# Altium schematic sheet 9.6 GHz LO Driver.SchDoc: 9.6 GHz LO Driver
size D; DrawnBy: C. Lewis; Engineer: C. Lewis; Address1: 4650 NORRIS CANYON RD.; Address2: SAN RAMON, CA 94583; DocumentNumber: 35133; Revision: D; SheetNumber: 16; SheetTotal: 20
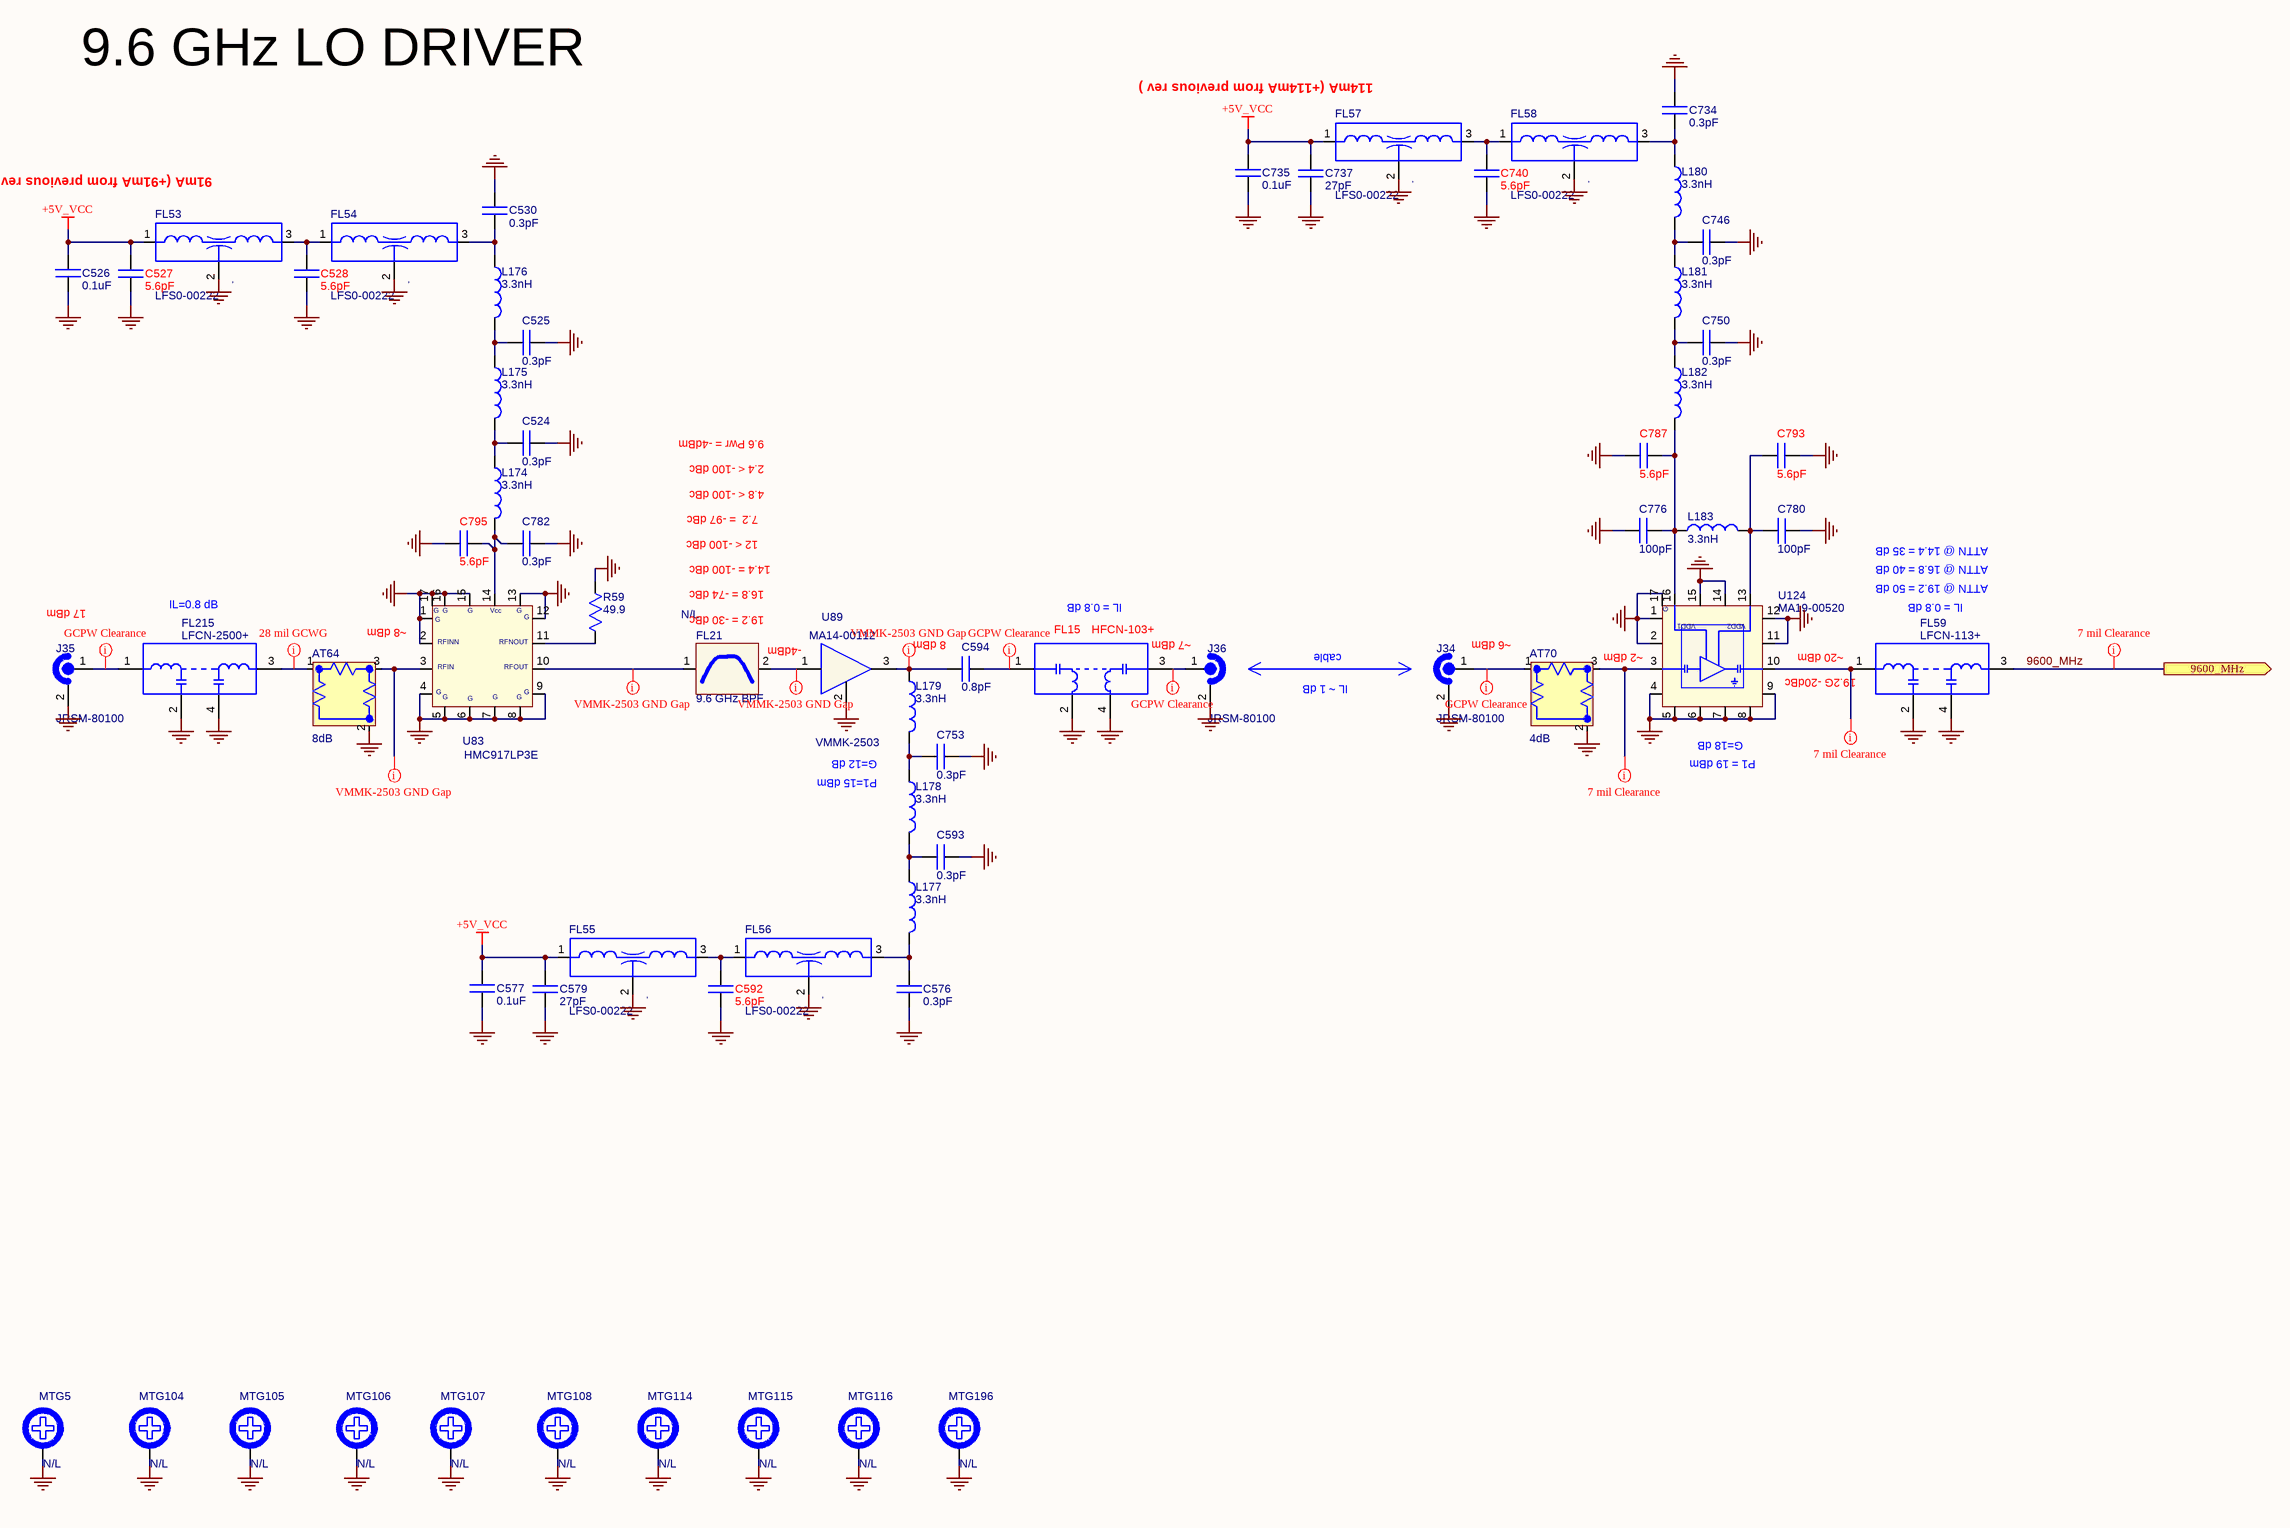
[diagram p0: 9.6 GHz LO Driver.SchDoc]

## Parts
AT64  value 8dB  [ATTN-IMS-0805]  (hidden comment: PAD;CHIP;8dB;+/-.3dB;.08 x .05;50 OHM;FACE DOWN)
AT70  value 4dB  [ATTN-IMS-0805]  (hidden comment: PAD;CHIP;4dB;+/-.3dB;.08 x .05;50 OHM;FACE DOWN)
C524  value 0.3pF  [CAP-0402-RF]  (hidden comment: .3 PF 200V .05PF HIGH Q SMT 0402)
C525  value 0.3pF  [CAP-0402-RF]  (hidden comment: .3 PF 200V .05PF HIGH Q SMT 0402)
C526  value 0.1uF  [CAP-0402-N]  (hidden comment: .1 UF,10%;X7R;16V,CHIP;0402)
C527  value 5.6pF  [CAP-0402-N]  (hidden comment: 5.6 PF;200V;.1PF;HIGH Q;SMT;CERAMIC;0402)
C528  value 5.6pF  [CAP-0402-N]  (hidden comment: 5.6 PF;200V;.1PF;HIGH Q;SMT;CERAMIC;0402)
C530  value 0.3pF  [CAP-0402-RF]  (hidden comment: .3 PF 200V .05PF HIGH Q SMT 0402)
C576  value 0.3pF  [CAP-0402-RF]  (hidden comment: .3 PF 200V .05PF HIGH Q SMT 0402)
C577  value 0.1uF  [CAP-0402-N]  (hidden comment: .1 UF,10%;X7R;16V,CHIP;0402)
C579  value 27pF  [CAP-0402-N]  (hidden comment: 27 PF;5%;COG;>50V;CHIP;0402)
C592  value 5.6pF  [CAP-0402-N]  (hidden comment: 5.6 PF;200V;.1PF;HIGH Q;SMT;CERAMIC;0402)
C593  value 0.3pF  [CAP-0402-RF]  (hidden comment: .3 PF 200V .05PF HIGH Q SMT 0402)
C594  value 0.8pF  [CAP-0402-RF]  (hidden comment: .8 PF;200V;.05PF;HIGH Q;SMT;CERAMIC;0402)
C734  value 0.3pF  [CAP-0402-RF]  (hidden comment: .3 PF 200V .05PF HIGH Q SMT 0402)
C735  value 0.1uF  [CAP-0402-N]  (hidden comment: .1 UF,10%;X7R;16V,CHIP;0402)
C737  value 27pF  [CAP-0402-N]  (hidden comment: 27 PF;5%;COG;>50V;CHIP;0402)
C740  value 5.6pF  [CAP-0402-N]  (hidden comment: 5.6 PF;200V;.1PF;HIGH Q;SMT;CERAMIC;0402)
C746  value 0.3pF  [CAP-0402-RF]  (hidden comment: .3 PF 200V .05PF HIGH Q SMT 0402)
C750  value 0.3pF  [CAP-0402-RF]  (hidden comment: .3 PF 200V .05PF HIGH Q SMT 0402)
C753  value 0.3pF  [CAP-0402-RF]  (hidden comment: .3 PF 200V .05PF HIGH Q SMT 0402)
C776  value 100pF  [CAP-0402-N]  (hidden comment: 100 PF;5%;COG;>50V;CHIP;0402)
C780  value 100pF  [CAP-0402-N]  (hidden comment: 100 PF;5%;COG;>50V;CHIP;0402)
C782  value 0.3pF  [CAP-0402-RF]  (hidden comment: .3 PF 200V .05PF HIGH Q SMT 0402)
C787  value 5.6pF  [CAP-0402-N]  (hidden comment: 5.6 PF;200V;.1PF;HIGH Q;SMT;CERAMIC;0402)
C793  value 5.6pF  [CAP-0402-N]  (hidden comment: 5.6 PF;200V;.1PF;HIGH Q;SMT;CERAMIC;0402)
C795  value 5.6pF  [CAP-0402-N]  (hidden comment: 5.6 PF;200V;.1PF;HIGH Q;SMT;CERAMIC;0402)
FL15  M_PN: HFCN-103+  [FV1206-4]  (hidden comment: FILTER;HI PASS;9700MHz;7SEC;FV1206-4;RoHS)
FL21  value 9.6 GHz BPF  NoLoad: N/L  [9.6_GHz_BPF]  (hidden comment: .)
FL53  Filter EMI 2200PF,1206  [FIL-NFE31P-1206-4P]  (value not drawn)
FL54  Filter EMI 2200PF,1206  [FIL-NFE31P-1206-4P]  (value not drawn)
FL55  Filter EMI 2200PF,1206  [FIL-NFE31P-1206-4P]  (value not drawn)
FL56  Filter EMI 2200PF,1206  [FIL-NFE31P-1206-4P]  (value not drawn)
FL57  Filter EMI 2200PF,1206  [FIL-NFE31P-1206-4P]  (value not drawn)
FL58  Filter EMI 2200PF,1206  [FIL-NFE31P-1206-4P]  (value not drawn)
FL59  M_PN: LFCN-113+  [FV1206-4]  (hidden comment: TER;LOW PASS;11.000GHZ;7 SECTIONS;.5A;FV1206-4)
FL215  M_PN: LFCN-2500+  [FV1206]  (hidden comment: FILTER;LOW PASS;2.500GHZ;5 SECTIONS;1A;1206)
J34  SMPM;FD;MALE;STRAIGHT;SMT;.152X.152X.150;PCB;R/A CONTACT  [JRSM-80100]  (value not drawn)
J35  SMPM;FD;MALE;STRAIGHT;SMT;.152X.152X.150;PCB;R/A CONTACT  [JRSM-80100]  (value not drawn)
J36  SMPM;FD;MALE;STRAIGHT;SMT;.152X.152X.150;PCB;R/A CONTACT  [JRSM-80100]  (value not drawn)
L174  value 3.3nH  [IND-0402HP]  (hidden comment: INDUCTOR;3.3NH;2%;12.8G SRF;95Q @1.7G;.045DCR;1.7A;0402)
L175  value 3.3nH  [IND-0402HP]  (hidden comment: INDUCTOR;3.3NH;2%;12.8G SRF;95Q @1.7G;.045DCR;1.7A;0402)
L176  value 3.3nH  [IND-0402HP]  (hidden comment: INDUCTOR;3.3NH;2%;12.8G SRF;95Q @1.7G;.045DCR;1.7A;0402)
L177  value 3.3nH  [IND-0402HP]  (hidden comment: INDUCTOR;3.3NH;2%;12.8G SRF;95Q @1.7G;.045DCR;1.7A;0402)
L178  value 3.3nH  [IND-0402HP]  (hidden comment: INDUCTOR;3.3NH;2%;12.8G SRF;95Q @1.7G;.045DCR;1.7A;0402)
L179  value 3.3nH  [IND-0402HP]  (hidden comment: INDUCTOR;3.3NH;2%;12.8G SRF;95Q @1.7G;.045DCR;1.7A;0402)
L180  value 3.3nH  [IND-0402HP]  (hidden comment: INDUCTOR;3.3NH;2%;12.8G SRF;95Q @1.7G;.045DCR;1.7A;0402)
L181  value 3.3nH  [IND-0402HP]  (hidden comment: INDUCTOR;3.3NH;2%;12.8G SRF;95Q @1.7G;.045DCR;1.7A;0402)
L182  value 3.3nH  [IND-0402HP]  (hidden comment: INDUCTOR;3.3NH;2%;12.8G SRF;95Q @1.7G;.045DCR;1.7A;0402)
L183  value 3.3nH  [IND-0402HP]  (hidden comment: INDUCTOR;3.3NH;2%;12.8G SRF;95Q @1.7G;.045DCR;1.7A;0402)
MTG5  NoLoad: N/L  [MHP200X92]
MTG104  NoLoad: N/L  [MHP200X92]
MTG105  NoLoad: N/L  [MHP200X92]
MTG106  NoLoad: N/L  [MHP200X92]
MTG107  NoLoad: N/L  [MHP200X92]
MTG108  NoLoad: N/L  [MHP200X92]
MTG114  NoLoad: N/L  [MHP200X92]
MTG115  NoLoad: N/L  [MHP200X92]
MTG116  NoLoad: N/L  [MHP200X92]
MTG196  NoLoad: N/L  [MHP200X92]
R59  value 49.9  [RES-0201-N]  (hidden comment: 49.9 OHMS;.05W;1%;200PPM;FILM CHIP;0201)
U83  M_PN: HMC917LP3E  [QFN-16_HITTITE_LP3]  (hidden comment: QUADRUPLER;1500-2500 MHZ IN;5DB CONV LOSS;0-10DBM IN;LP3E)
U89  M_PN: VMMK-2503  [AMP-VMMK-2503]  (hidden comment: AMP;1-12GHz;13.5dB;+17dBm;5V;68mA;WLP-0402)
U124  AMP;5-11GHz;21dB;+19dBm;5V;114mA;LC3  [QFN-16_HITTITE_LC3_036]  (value not drawn)

## Ports
9600_MHz

## Nets
+5V_VCC: C526.1 C527.2 C577.1 C579.2 C735.1 C737.2 FL53.1(IN) FL55.1(IN) FL57.1(IN)
GND: AT64.2(GND) AT70.2(GND) C524.1 C525.1 C526.2 C527.1 C528.1 C530.1 C576.1 C577.2 C579.1 C592.1 C593.1 C734.1 C735.2 C737.1 C740.1 C746.1 C750.1 C753.1 C776.1 C780.1 C782.1 C787.2 C793.2 C795.2 FL15.2(GND) FL15.4(GND) FL53.2(GND) FL54.2(GND) FL55.2(GND) FL56.2(GND) FL57.2(GND) FL58.2(GND) FL59.2(GND) FL59.4(GND) FL215.2(GND) FL215.4(GND) J34.2(GND) J35.2(GND) J36.2(GND) MTG5.MH MTG104.MH MTG105.MH MTG106.MH MTG107.MH MTG108.MH MTG114.MH MTG115.MH MTG116.MH MTG196.MH R59.2 U83.1(Vdd) U83.2(Vctl) U83.4(NC) U83.5(EN) U83.6(NC) U83.7(NC) U83.8(NC) U83.9(RF1) U83.12(RF2) U83.13(NC) U83.15(NC) U83.16(NC) U83.17(GND) U89.2(GND) U124.1(NC) U124.2(NC) U124.4(NC) U124.5(NC) U124.6(NC) U124.7(NC) U124.8(NC) U124.9(NC) U124.11(NC) U124.12(NC) U124.14(NC) U124.15(NC) U124.17(GND)
9600_MHz: FL59.3(OUT) ; port 9600_MHz
NetAT64_1: AT64.1(IN/OUT) FL215.3(OUT)
NetAT64_3: AT64.3(IN/OUT) U83.3(RFC)
NetAT70_1: AT70.1(IN/OUT) J34.1(CNTR)
NetAT70_3: AT70.3(IN/OUT) U124.3(RF_IN)
NetC524_2: C524.2 L174.2 L175.1
NetC525_2: C525.2 L175.2 L176.1
NetC528_2: C528.2 FL53.3(OUT) FL54.1(IN)
NetC530_2: C530.2 FL54.3(OUT) L176.2
NetC576_2: C576.2 FL56.3(OUT) L177.2
NetC592_2: C592.2 FL55.3(OUT) FL56.1(IN)
NetC593_2: C593.2 L177.1 L178.2
NetC594_1: C594.1 FL15.1(IN)
NetC594_2: C594.2 L179.1 U89.3(OUT)
NetC734_2: C734.2 FL58.3(OUT) L180.2
NetC740_2: C740.2 FL57.3(OUT) FL58.1(IN)
NetC746_2: C746.2 L180.1 L181.2
NetC750_2: C750.2 L181.1 L182.2
NetC753_2: C753.2 L178.1 L179.2
NetC776_2: C776.2 C787.1 L182.1 L183.2 U124.16(VDD1)
NetC780_2: C780.2 C793.1 L183.1 U124.13(VDD2)
NetC782_2: C782.2 C795.1 L174.1 U83.14(NC)
NetFL15_3: FL15.3(OUT) J36.1(CNTR)
NetFL21_1: FL21.1(IN) U83.10(GND)
NetFL21_2: FL21.2(OUT) U89.1(IN)
NetFL59_1: FL59.1(IN) U124.10(RF_OUT)
NetFL215_1: FL215.1(IN) J35.1(CNTR)
NetR59_1: R59.1 U83.11(GND)

## Layout directives
net class GCPW Clearance: NetAT70_1, NetC594_1, NetFL15_3, NetFL215_1
net class 7 mil Clearance: 9600_MHz, NetAT70_3, NetFL59_1
net class VMMK-2503 GND Gap: NetAT64_3, NetC594_2, NetFL21_1, NetFL21_2
net class 28 mil GCWG: NetAT64_1

## Notes on the sheet
- 9.6 GHz LO DRIVER
- 114mA (+114mA from previous rev )
- 91mA (+91mA from previous rev )
- 9.6 Pwr = -4dBm
- 2.4 < -100 dBc
- 7.2  = -97 dBc
- 12 < -100 dBc
- 4.8 < -100 dBc
- ATTN @ 14.4 = 35 dB
- 17 dBm
- 16.8 = -74 dBc
- 14.4 = -100 dBc
- IL = 0.8 dB
- ATTN @ 16.8 = 40 dB
- ATTN @ 19.2 = 50 dB
- IL=0.8 dB
- ~8 dBm
- (near FL21) 19.2 = -30 dBc
- -4dBm
- 8 dBm
- ~7 dBm
- cable
- ~6 dBm
- ~2 dBm
- ~20 dBm
- 19.2G -20dBc
- IL ~ 1 dB
- G=12 dB
- (near L178) P1=15 dBm
- (near U124) G=18 dB
- P1 = 19 dBm
- Title
- Sheet Title
- PRINTED DOCUMENT IS CONSIDERED UNCONTROLLED. VERIFY REVISION IN PLM SYSTEM.
- THIS DOCUMENT CONTAINS PROPRIETARY INFORMATION. DESIGN RIGHTS BELONG TO GIGA-TRONICS AND MAY NOT BE REPRODUCED WITHOUT WRITTEN AUTHORIZATION FOR ANY REASON EXCEPT CALIBRATION, OPERATION AND MAINTENANCE.
- Size
- CAGE CODE
- Filename
- D
- Document Number
- 58900
- Date
- Sheet
- Rev
- of
- (in symbol LFS0-00222) ,
- (in symbol MA19-00520) G
- (in symbol MX04-00305) G; Vcc; RFINN; RFNOUT; RFIN; RFOUT

## Library data of the parts
AT64 = MPFC-A1008: NoLoad: .; Approved: CL; M_PN: IMS1141-08DB; MFGR: IMS RESISTORS; level: 1; line_number: 38; ModifyDate: 4/23/13; G_PN: MPFC-A1008; item_number: MPFC-A1008
AT70 = MPFC-A1004: NoLoad: .; Approved: CL; M_PN: IMS1141-04DB; MFGR: IMS RESISTORS; level: 1; line_number: 30; ModifyDate: 3/8/13; G_PN: MPFC-A1004; item_number: MPFC-A1004
C524 C525 C530 C576 C593 C734 C746 C750 C753 C782 = CK41-00003: Approved: CL; NoLoad: .; M_PN: 600L0R3AT200T; MFGR: ATC; level: 1; line_number: 140; G_PN: CK41-00003; ModifyDate: 01/23/14; item_number: CK41-00003
C526 C577 C735 = CK40-04100: Approved: CL; NoLoad: .; M_PN: C0402X7R160-104KNP; MFGR: VENKEL; level: 1; line_number: 95; ModifyDate: 3/29/13; G_PN: CK40-04100; item_number: CK40-04100
C527 C528 C592 C740 = CK41-00056: MFGR: ATC; M_PN: 600L5R6BT200; Approved: CL; NoLoad: .; level: 1; line_number: 120; ModifyDate: 3/11/13; G_PN: CK41-00056; item_number: CK41-00056
C579 C737 = CK40-00270: MFGR: ANY; Approved: CL; NoLoad: .; level: 1; line_number: 215; ModifyDate: 02/22/12; M_PN: ANY; G_PN: CK40-00270; item_number: CK40-00270
C594 = CK41-00008: Approved: CL; NoLoad: .; M_PN: 600L0R8AT200; MFGR: ATC; level: 1; line_number: 230; G_PN: CK41-00008; ModifyDate: 02/22/12; item_number: CK41-00008
C776 C780 = CK40-01100: Approved: CL; NoLoad: .; M_PN: Any; level: 1; line_number: 70; G_PN: CK40-01100; ModifyDate: 3/21/12; MFGR: Any; item_number: CK40-01100
C787 C793 C795 = CK41-00056: Approved: CL; NoLoad: .; M_PN: 600L5R6BT200; MFGR: ATC; level: 1; line_number: 120; ModifyDate: 3/11/13; G_PN: CK41-00056; item_number: CK41-00056
FL15 = MFH0-09700: MFGR: MINI-CIRCUITS; Approved: CL; Value: HFCN-103+; NoLoad: .; level: 1; line_number: 342; G_PN: MFH0-09700; ModifyDate: 1/22/15; item_number: MFH0-09700
FL21 = 9.6 GHz BPF: Approved: CL; level: 1; ModifyDate: 6/2/13
FL53-FL58 = LFS0-00222: Approved: CL; NoLoad: .; M_PN: NFE31PT222Z1E9BL; MFGR: MURATA; level: 1; line_number: 335; G_PN: LFS0-00222; ModifyDate: 02/22/12; Value: 2200pF; item_number: LFS0-00222
FL59 = MFL0-11000: MFGR: MINI-CIRCUITS; Approved: CL; Value: LFCN-113+; NoLoad: .; level: 1; line_number: 395; G_PN: MFL0-11000; ModifyDate: 3/14/13; item_number: MFL0-11000
FL215 = MFL0-02500: MFGR: MINI-CIRCUITS; Approved: CL; Value: LFCN-2500+; NoLoad: .; level: 1; line_number: 460; G_PN: MFL0-02500; ModifyDate: 3/5/13; item_number: MFL0-02500
J34-J36 = JRSM-80100: Value: B012-P93-01; MFGR: Corning Gilbert; Approved: CL; NoLoad: .; level: 1; line_number: 486; M_PN: B012-P93-01; ModifyDate: 10/15/14; G_PN: JRSM-80100; item_number: JRSM-80100
L174-L183 = LSA6-02330: M_PN: 0402HP-3N3XGLU; MFGR: COILCRAFT; NoLoad: .; Approved: CL; level: 1; line_number: 527; G_PN: LSA6-02330; ModifyDate: 12/4/14; item_number: LSA6-02330
MTG5 MTG104-MTG108 MTG114-MTG116 MTG196 = MHP200X92: level: 1; ModifyDate: 02/14/2008 14:07:19; Value: *
R59 = RK30-00499: Approved: CL; NoLoad: .; MFGR: Vishay-Dale; M_PN: CRCW020149R9FNED; level: 1; line_number: 970; G_PN: RK30-00499; ModifyDate: 2-11-14; item_number: RK30-00499
U83 = MX04-00305: MFGR: HITTITE; Approved: CL; Value: HMC917LP3E; NoLoad: .; level: 1; line_number: 1318; ModifyDate: 11.22/13; G_PN: MX04-00305; item_number: MX04-00305
U89 = MA14-00112: NoLoad: .; Approved: NM; MFGR: AVAGO; level: 1; line_number: 1340; ModifyDate: 11/28/12; G_PN: MA14-00112; item_number: MA14-00112
U124 = MA19-00520: NoLoad: .; Approved: CL; MFGR: HITTITE; Value: HMC451LC3; level: 1; line_number: 1323; ModifyDate: 1/25/13; M_PN: HMC451LC3; G_PN: MA19-00520; item_number: MA19-00520